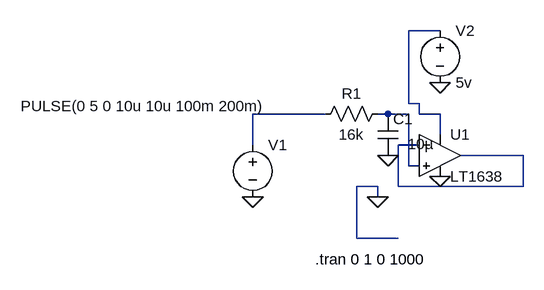
[diagram p0: schematic Active LPF (with amplifcation).asc]
Active LPF (with amplifcation).asc, the LTspice schematic file:
Version 4
SHEET 1 880 680
WIRE 256 -48 208 -48
WIRE 208 64 208 -48
WIRE 224 64 208 64
WIRE 80 80 -32 80
WIRE 176 80 160 80
WIRE 208 80 176 80
WIRE 224 80 224 64
WIRE 256 80 224 80
WIRE 256 112 256 80
WIRE -32 128 -32 80
WIRE 224 128 192 128
WIRE 384 144 288 144
WIRE 208 160 208 80
WIRE 224 160 208 160
WIRE 160 192 128 192
WIRE 192 192 192 128
WIRE 384 192 384 144
WIRE 384 192 192 192
WIRE 160 208 160 192
WIRE 128 272 128 192
WIRE 192 272 128 272
FLAG 160 208 0
FLAG 256 32 0
FLAG -32 208 0
FLAG 176 144 0
FLAG 256 176 0
SYMBOL res 64 96 R270
WINDOW 0 32 56 VTop 2
WINDOW 3 0 56 VBottom 2
SYMATTR InstName R1
SYMATTR Value 16k
SYMBOL cap 160 80 R0
WINDOW 3 46 46 Left 2
SYMATTR Value 10µ
SYMATTR InstName C1
SYMBOL voltage -32 112 R0
WINDOW 3 -357 -44 Left 2
WINDOW 123 0 0 Left 0
WINDOW 39 0 0 Left 0
SYMATTR Value PULSE(0 5 0 10u 10u 100m 200m)
SYMATTR InstName V1
SYMBOL OpAmps\\LT1638 256 80 R0
SYMATTR InstName U1
SYMBOL voltage 256 -64 R0
SYMATTR InstName V2
SYMATTR Value 5v
TEXT 64 304 Left 2 !.tran 0 1 0 1000

The netlist it stands for:
* Active LPF (with amplifcation).asc
R1 N002 N003 16k
C1 N003 0 10µ
V1 N002 0 PULSE(0 5 0 10u 10u 100m 200m)
XU1 N003 N004 N001 0 N004 LT1638  ; pins In+ In- V+ V- OUT
V2 N001 0 5v
.tran 0 1 0 1000
.backanno
.end